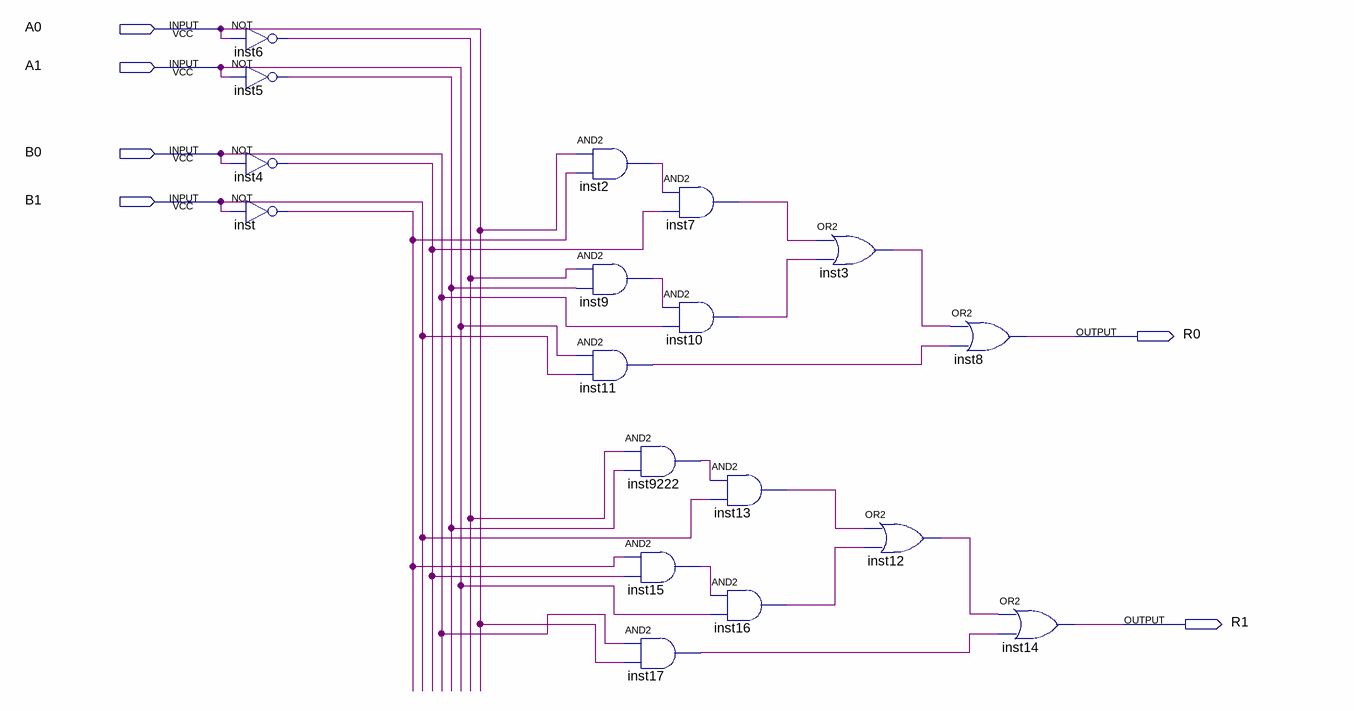
[diagram p0: schematic sheet]
// Quartus schematic FAx2_MOD_3.bdf as structural Verilog: 18 symbols, 6 pins
module FAx2_MOD_3 (
  input  A0,
  input  A1,
  input  B0,
  input  B1,
  output R0,
  output R1
);

  wire inst2_out, inst3_out, inst4_out, inst5_out, inst6_out, inst7_out, inst9_out, inst10_out, inst11_out,
       inst12_out, inst13_out, inst15_out, inst16_out, inst17_out, inst9222_out, inst_out;

  not inst6 (inst6_out, A0);
  not inst5 (inst5_out, A1);
  not inst4 (inst4_out, B0);
  not inst (inst_out, B1);
  and inst2 (inst2_out, A0, inst_out);
  and inst9 (inst9_out, inst6_out, inst5_out);
  and inst11 (inst11_out, A1, B1);
  and inst9222 (inst9222_out, inst6_out, inst5_out);
  and inst15 (inst15_out, inst_out, inst4_out);
  and inst17 (inst17_out, B0, A0);
  and inst7 (inst7_out, inst2_out, inst4_out);
  and inst10 (inst10_out, inst9_out, B0);
  and inst13 (inst13_out, inst9222_out, B1);
  and inst16 (inst16_out, inst15_out, A1);
  or inst3 (inst3_out, inst7_out, inst10_out);
  or inst12 (inst12_out, inst13_out, inst16_out);
  or inst8 (R0, inst3_out, inst11_out);
  or inst14 (R1, inst12_out, inst17_out);
endmodule
